# EAGLE schematic Module_T+H_03v (EAGLE 7.7.0)
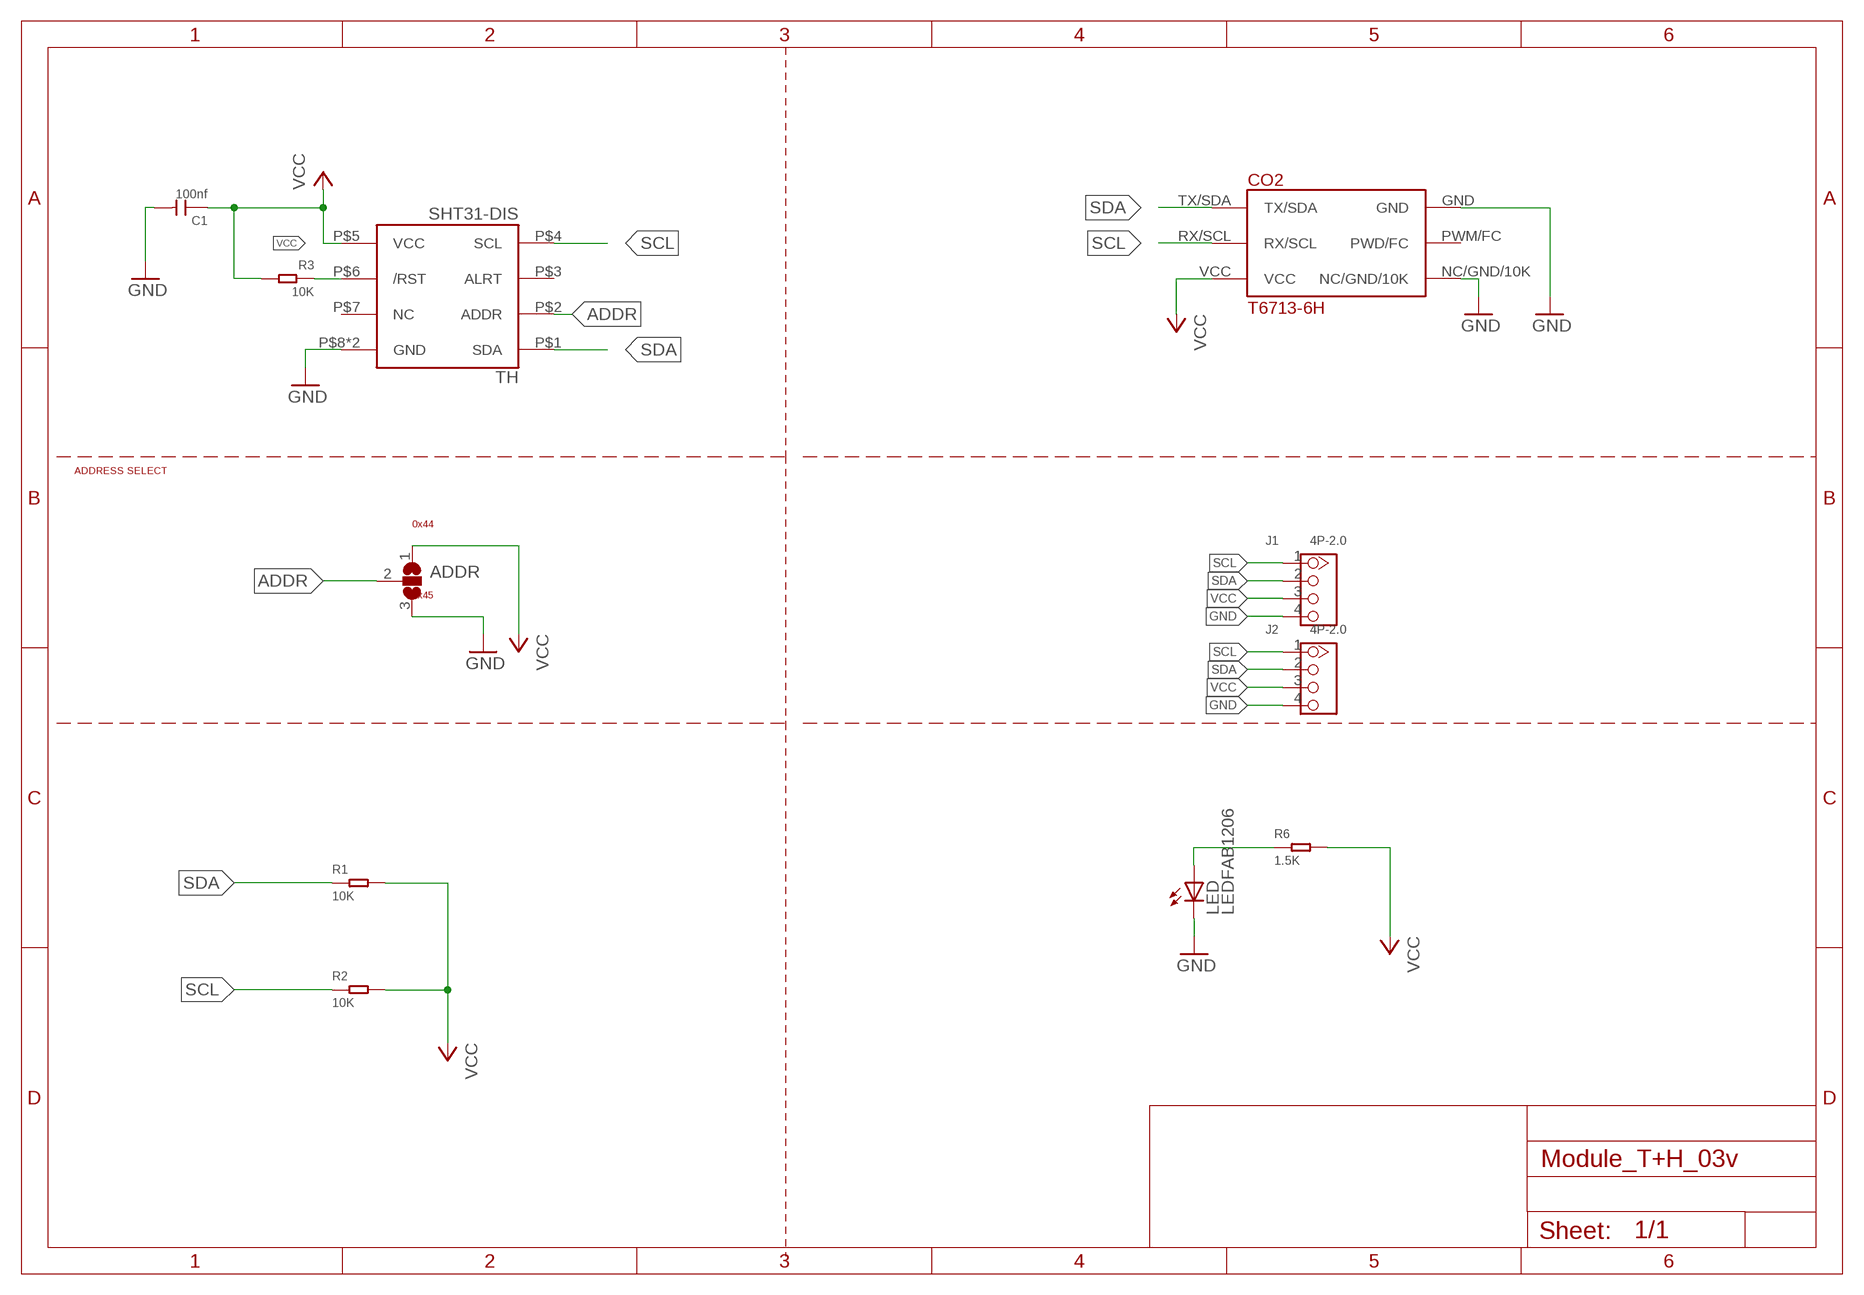
[diagram p0: schematic, sheet 1]

## Parts
ADDR  SJ2W  [SJ_2]
C1  100nf  CERAMIC-100NF-50V-10%-X7R(0805)  [C0805]
CO2  T6713-6H  [PINS]
J1  4P-2.0  GROVE-CONNECTOR-DIP(4P-2.0)  [HW4-2.0]
J2  4P-2.0  GROVE-CONNECTOR-DIP(4P-2.0)  [HW4-2.0]
LED  LEDFAB1206  [LED1206FAB]
R1  10K  SMD-RES-10K-1%-1/8W(0805)  [R0805]
R2  10K  SMD-RES-10K-1%-1/8W(0805)  [R0805]
R3  10K  SMD-RES-10K-1%-1/8W(0805)  [R0805]
R6  1.5K  SMD-RES-1.5K-1%-1/8W(0805)  [R0805]
TH  SHT31-DIS  [SHT3X]

## Nets
ADDR: ADDR.2 TH.P$2(ADDR)
GND: ADDR.3 C1.2 CO2.GND CO2.NC/GND/10K J1.4 J2.4 LED.2(C) TH.P$8(GND) TH.PAD(GND)
N$1: LED.1(A) R6.1
RST: R3.1 TH.P$6(/RST)
SCL: CO2.RX/SCL J1.1 J2.1 R2.1 TH.P$4(SCL)
SDA: CO2.TX/SDA J1.2 J2.2 R1.1 TH.P$1(SDA)
VCC: ADDR.1 C1.1 CO2.VCC J1.3 J2.3 R1.2 R2.2 R3.2 R6.2 TH.P$5(VCC)
Unconnected: CO2.PWM/FC(PWD/FC) TH.P$3(ALRT) TH.P$7(NC)

## Notes on the sheet
- ADDRESS SELECT
- 0x44
- 0x45

## Library data of the parts
ADDR = jumper:SJ2W: SMD solder JUMPER
C1 = Seeed-OPL-Capacitor:CERAMIC-100NF-50V-10%-X7R(0805): 302010165; MPN: CC0805KRX7R9BB104
CO2 = T6713-6H:T6713-6H
J1 J2 = Seeed-OPL-Connector:GROVE-CONNECTOR-DIP(4P-2.0): 320110033
LED = fab_2:LED: LED
R1-R3 = Seeed-OPL-Resistor:SMD-RES-10K-1%-1/8W(0805): 301010361; MPN: RC0805FR-0710KL
R6 = Seeed-OPL-Resistor:SMD-RES-1.5K-1%-1/8W(0805): 301010394; MPN: RC0805FR-071K5L
TH = thomasb9511:SHT31-DIS